# Altium project SAMC21_Xplained_Pro.PrjPCB (part 2 of 2)

## Sheet SAMC21_Xplained_Pro_CAN_LIN.SchDoc: CAN & LIN Interface
size A3; Organization: ATMEL Norway; Address1: Vestre Rosten 79; Address2: N-7075 TILLER; Address3: NORWAY; DocumentNumber: A09-2419; Revision: 5; SheetNumber: 6; SheetTotal: 9; PageSetup: Record=PageOptions|CenterHorizontal=True|CenterVertical=True|PrintScale=1.01|XCorrection=1.00|YCorrection=1.00|PrintKind=1|BorderSize=5000000|LeftOffset=0|BottomOffset=0|Orientation=2|PaperLength=1000|PaperWidth=1000|Scale=100|PaperSource=7|PrintQuality=-4|MediaType=1|DitherType=10|PaperKind=A3 (297 x 420 mm)|PrintScaleMode=1; ProjectName: SAM C21 Xplained Pro
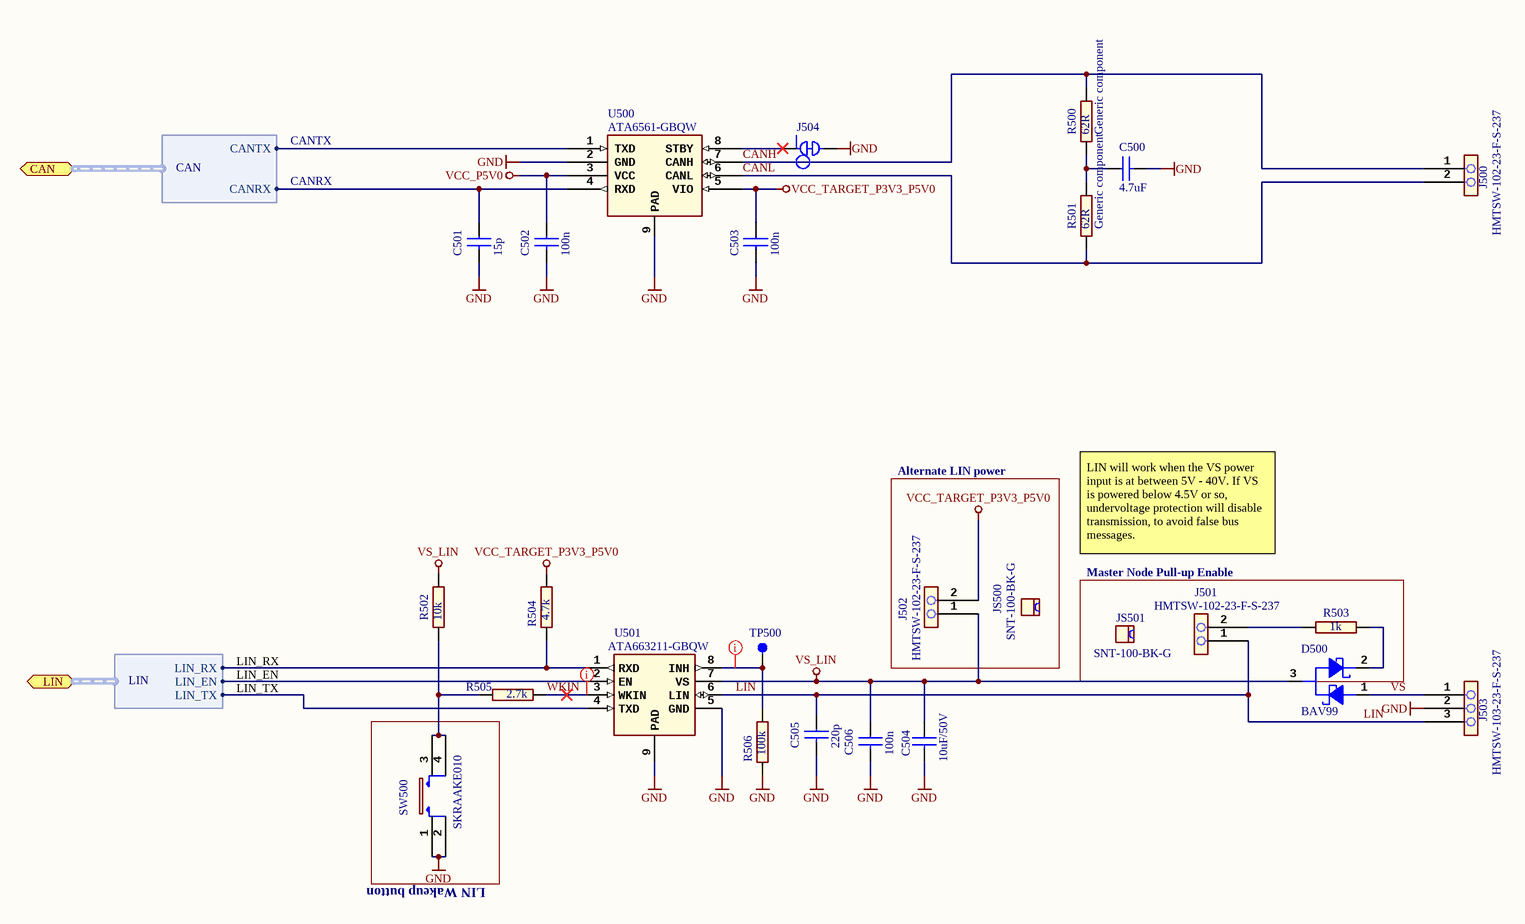
[diagram p5: SAMC21_Xplained_Pro_CAN_LIN.SchDoc]

### Parts
C500  value 4.7uF  [AP1-00003]
C501  value 15p  [AP1-00001]
C502  value 100n  [AP1-00001]
C503  value 100n  [AP1-00001]
C504  value 10uF/50V  [AP1-00015]
C505  value 220p  [AP1-00001]
C506  value 100n  [AP1-00001]
D500  value BAV99  [AP4-00018]
J500  value HMTSW-102-23-F-S-237  [AP8-00733]
J501  value HMTSW-102-23-F-S-237  [AP8-00733]
J502  value HMTSW-102-23-F-S-237  [AP8-00733]
J503  value HMTSW-103-23-F-S-237  [AP8-00745]
J504  (no value)  [AP9-00044]  (net tie, no BOM)
JS500  value SNT-100-BK-G  [AP8-00525]
JS501  value SNT-100-BK-G  [AP8-00525]
R500  Generic component  value 62R  [AP2-00008]
R501  Generic component  value 62R  [AP2-00008]
R502  value 10k  [AP2-00000]
R503  value 1k  [AP2-00000]
R504  value 4.7k  [AP2-00000]
R505  value 2.7k  [AP2-00000]
R506  value 100k  [AP2-00000]
SW500  value SKRAAKE010  [AP8-00137]
TP500  (no value)  [AP8-00010]  (no BOM)
U500  value ATA6561-GBQW  [AP6-00407]
U501  value ATA663211-GBQW  [AP6-00407]

### Blocks framed on the sheet
Alternate LIN power: J502 JS500
Master Node Pull-up Enable: D500 J501 JS501 R503
LIN Wakeup button: SW500

### Ports
CAN (harness CAN), LIN (harness LIN)

### Harnesses
CAN: CANTX, CANRX
LIN: LIN_RX, LIN_EN, LIN_TX

### Nets
GND: C500.2 C501.2 C502.2 C503.2 C504.2 C505.2 C506.2 J503.2 J504.2 R506.1 SW500.1 SW500.2 U500.2(GND) U500.9(PAD) U501.5(GND) U501.9(PAD)
VCC_P5V0: C502.1 U500.3(VCC)
VCC_TARGET_P3V3_P5V0: C503.1 J502.2 R504.2 U500.5(VIO)
VS_LIN: C504.1 C506.1 D500.3(ANODE_CATHODE) J502.1 R502.2 U501.7(VS)
CANH: J500.1 R500.2 U500.7(CANH)
CANL: J500.2 R501.1 U500.6(CANL)
LIN: C505.1 J501.1 J503.3 U501.6(LIN)
PA06_S0_LIN_TX: U501.4(TXD) ; port LIN.LIN_TX
PA07_S0_LIN_RX: R504.1 U501.1(RXD) ; port LIN.LIN_RX
PA24_CAN0_TX: U500.1(TXD) ; port CAN.CANTX
PA25_CAN0_RX: C501.1 U500.4(RXD) ; port CAN.CANRX
PB22_LIN_EN: U501.2(EN) ; port LIN.LIN_EN
VS: D500.1(ANODE) J503.1
WKIN: R505.2 U501.3(WKIN)
NetC500_1: C500.1 R500.1 R501.2
NetD500_2: D500.2(CATHODE) R503.2
NetJ501_2: J501.2 R503.1
NetJ504_1: J504.1 U500.8(STBY)
NetR502_1: R502.1 R505.1 SW500.3 SW500.4
NetR506_2: R506.2 TP500.1 U501.8(INH)

### Layout directives
rule Assembly Testpoint Usage [Testpoint - Not Allowed    Multiple - Not Allowed]: NetR506_2, WKIN

### Notes on the sheet
- CANTX
- CANRX
- LIN will work when the VS power input is at between 5V - 40V. If VS is powered below 4.5V or so, undervoltage protection will disable transmission, to avoid false bus messages.
- LIN_RX
- LIN_TX
- LIN_EN
- Date:
- PAGE:
- of
- TITLE:
- Document number:
- Revision:

### Library data of the parts
C500 = A01-0400: Ceramic capacitor, SMD 0805, X5R, 25V, ±10 %; PartGroup: Capacitors,Ceramic,SMD 0805; Manufacturer: Murata; MPN: GRM21BR61E475KA12L; Tolerance: Â±10%; AN: A01-0400; Height: 1,25
C501 = A01-0017: Ceramic capacitor, SMD 0402, NP0, 50V, +/-5%; PartGroup: Capacitors,Ceramic,SMD 0402; TemperatureRange: -55 - +125 deg C; AN: A01-0017; Tolerance: 50V, +/-5%; Height: 0,550000011920929
C502 C503 C506 = A01-0246: as C304 on sheet SAMC21_Xplained_Pro_Target_MCU; AN: A01-0246; Tolerance: 16V, +/-10%; Height: 0,5
C504 = A01-0586: Ceramic capacitor, SMD 1210, X7S , 50V, Â±10%; PartGroup: Capacitors,Ceramic,SMD 1210; Manufacturer: tdk; MPN: CGA6P3X7S1H106K250AB; TemperatureRange: -55 - +125 deg C; AN: A01-0586; Tolerance: 50V, Â±10%; Height: 2,5
C505 = A01-0030: Ceramic capacitor, SMD 0402, X7R, 50V, +/-10%; PartGroup: Capacitors,Ceramic,SMD 0402; TemperatureRange: -55 - +125 deg C; AN: A01-0030; Tolerance: 50V, +/-10%; Height: 0,550000011920929
D500 = A04-0011: High-speed Double Diode; PartGroup: Diodes,Schottky; Manufacturer: Philips; AN: A04-0011; Height: 1,10000002384186; MPN: BAV99
J500-J502 = A08-1754: 1x2 pin header, 2.54mm pitch, Pin-in-Paste THM; PartGroup: Mechanical devices,Connectors,Pin headers; Manufacturer: SAMTEC; TemperatureRange: - 55 deg C to + 125 deg C; AN: A08-1754; Height: 6,09999990463257; MPN: HMTSW-102-23-F-S-237
J503 = A08-1799: 1x3 pin header, 2.54mm pitch, Pin-in-Paste THM, 1mm hole; PartGroup: Mechanical devices,Connectors,Pin headers; Manufacturer: SAMTEC; AN: A08-1799; Height: 6,09999990463257; MPN: HMTSW-103-23-F-S-237
J504 = A09-0783: Default closed SMD strap, 0603 size; PartGroup: Mechanical devices,PCB implemented components; Value: SMD-STRAP_0603_CLOSED; AN: A09-0783; Height: 0
JS500 JS501 = A08-0543: Jumper cap for 2.54mm pinheader; PartGroup: Mechanical devices,Mounting accessories,Other; Manufacturer: SAMTEC; AN: A08-0543; MPN: SNT-100-BK-G
R500 R501 = A02-0760: Thick film resistor, SMD 1210, 0.5W, 1%; PartGroup: Resistors,SMD,1210 1%; TemperatureRange: -55°C to +155°C; AN: A02-0760; Tolerance: 1%; Height: 0,699999988079071
R502 = A02-0236: as R105 on sheet SAMC21_Xplained_Pro_dual_input_power_supply; AN: A02-0236; Tolerance: 1 %; Height: 0,349999994039536
R503 = A02-0212: Thick film resistor, SMD 0402, 1/16W, 1%; PartGroup: Resistors,SMD,0402 1%; TemperatureRange: -55 - +125 deg C; AN: A02-0212; Tolerance: 1 %; Height: 0,349999994039536
R504 = A02-0228: as R305 on sheet SAMC21_Xplained_Pro_Target_MCU; AN: A02-0228; Tolerance: 1 %; Height: 0,349999994039536
R505 = A02-0222: Thick film resistor, SMD 0402, 1/16W, 1%; PartGroup: Resistors,SMD,0402 1%; TemperatureRange: -55 - +125 deg C; AN: A02-0222; Tolerance: 1 %; Height: 0,349999994039536
R506 = A02-0260: as R300 on sheet SAMC21_Xplained_Pro_Target_MCU; AN: A02-0260; Tolerance: 1 %; Height: 0,349999994039536
SW500 = A08-0790: as SW301 on sheet SAMC21_Xplained_Pro_Target_MCU; AN: A08-0790; Height: 5,09999990463257; MPN: SKRAAKE010
TP500 = A08-0004: as TP301 on sheet SAMC21_Xplained_Pro_Target_MCU; AN: A08-0004; Value: TESTPAD; Height: 0
U500 = A06-1172: 5Mbit/s CAN Trasceiver,VCC = 5V, VIO = 2.8-5V, 3x3 mm VDFN8; PartGroup: Integrated Circuits,Interface ICs,CAN; Manufacturer: ATMEL; AN: A06-1172; Height: 0,899999976158142; MPN: ATA6561-GBQW
U501 = A06-1194: LIN Transceiver; PartGroup: Integrated Circuits,Interface ICs,LIN; Manufacturer: ATMEL; AN: A06-1194; Height: 0,899999976158142; MPN: ATA663211-GBQW

## Sheet SAMC21_Xplained_Pro_Arduino_Connectors.SchDoc: Arduino Uno interface connectors
size A3; Organization: ATMEL Norway; Address1: Vestre Rosten 79; Address2: N-7075 TILLER; Address3: NORWAY; DocumentNumber: A09-2419; Revision: 5; SheetNumber: 9; SheetTotal: 9; PageSetup: Record=PageOptions|CenterHorizontal=True|CenterVertical=True|PrintScale=1.01|XCorrection=1.00|YCorrection=1.00|PrintKind=1|BorderSize=5000000|LeftOffset=0|BottomOffset=0|Orientation=2|PaperLength=1000|PaperWidth=1000|Scale=100|PaperSource=7|PrintQuality=-4|MediaType=1|DitherType=10|PaperKind=A3 (297 x 420 mm)|PrintScaleMode=1
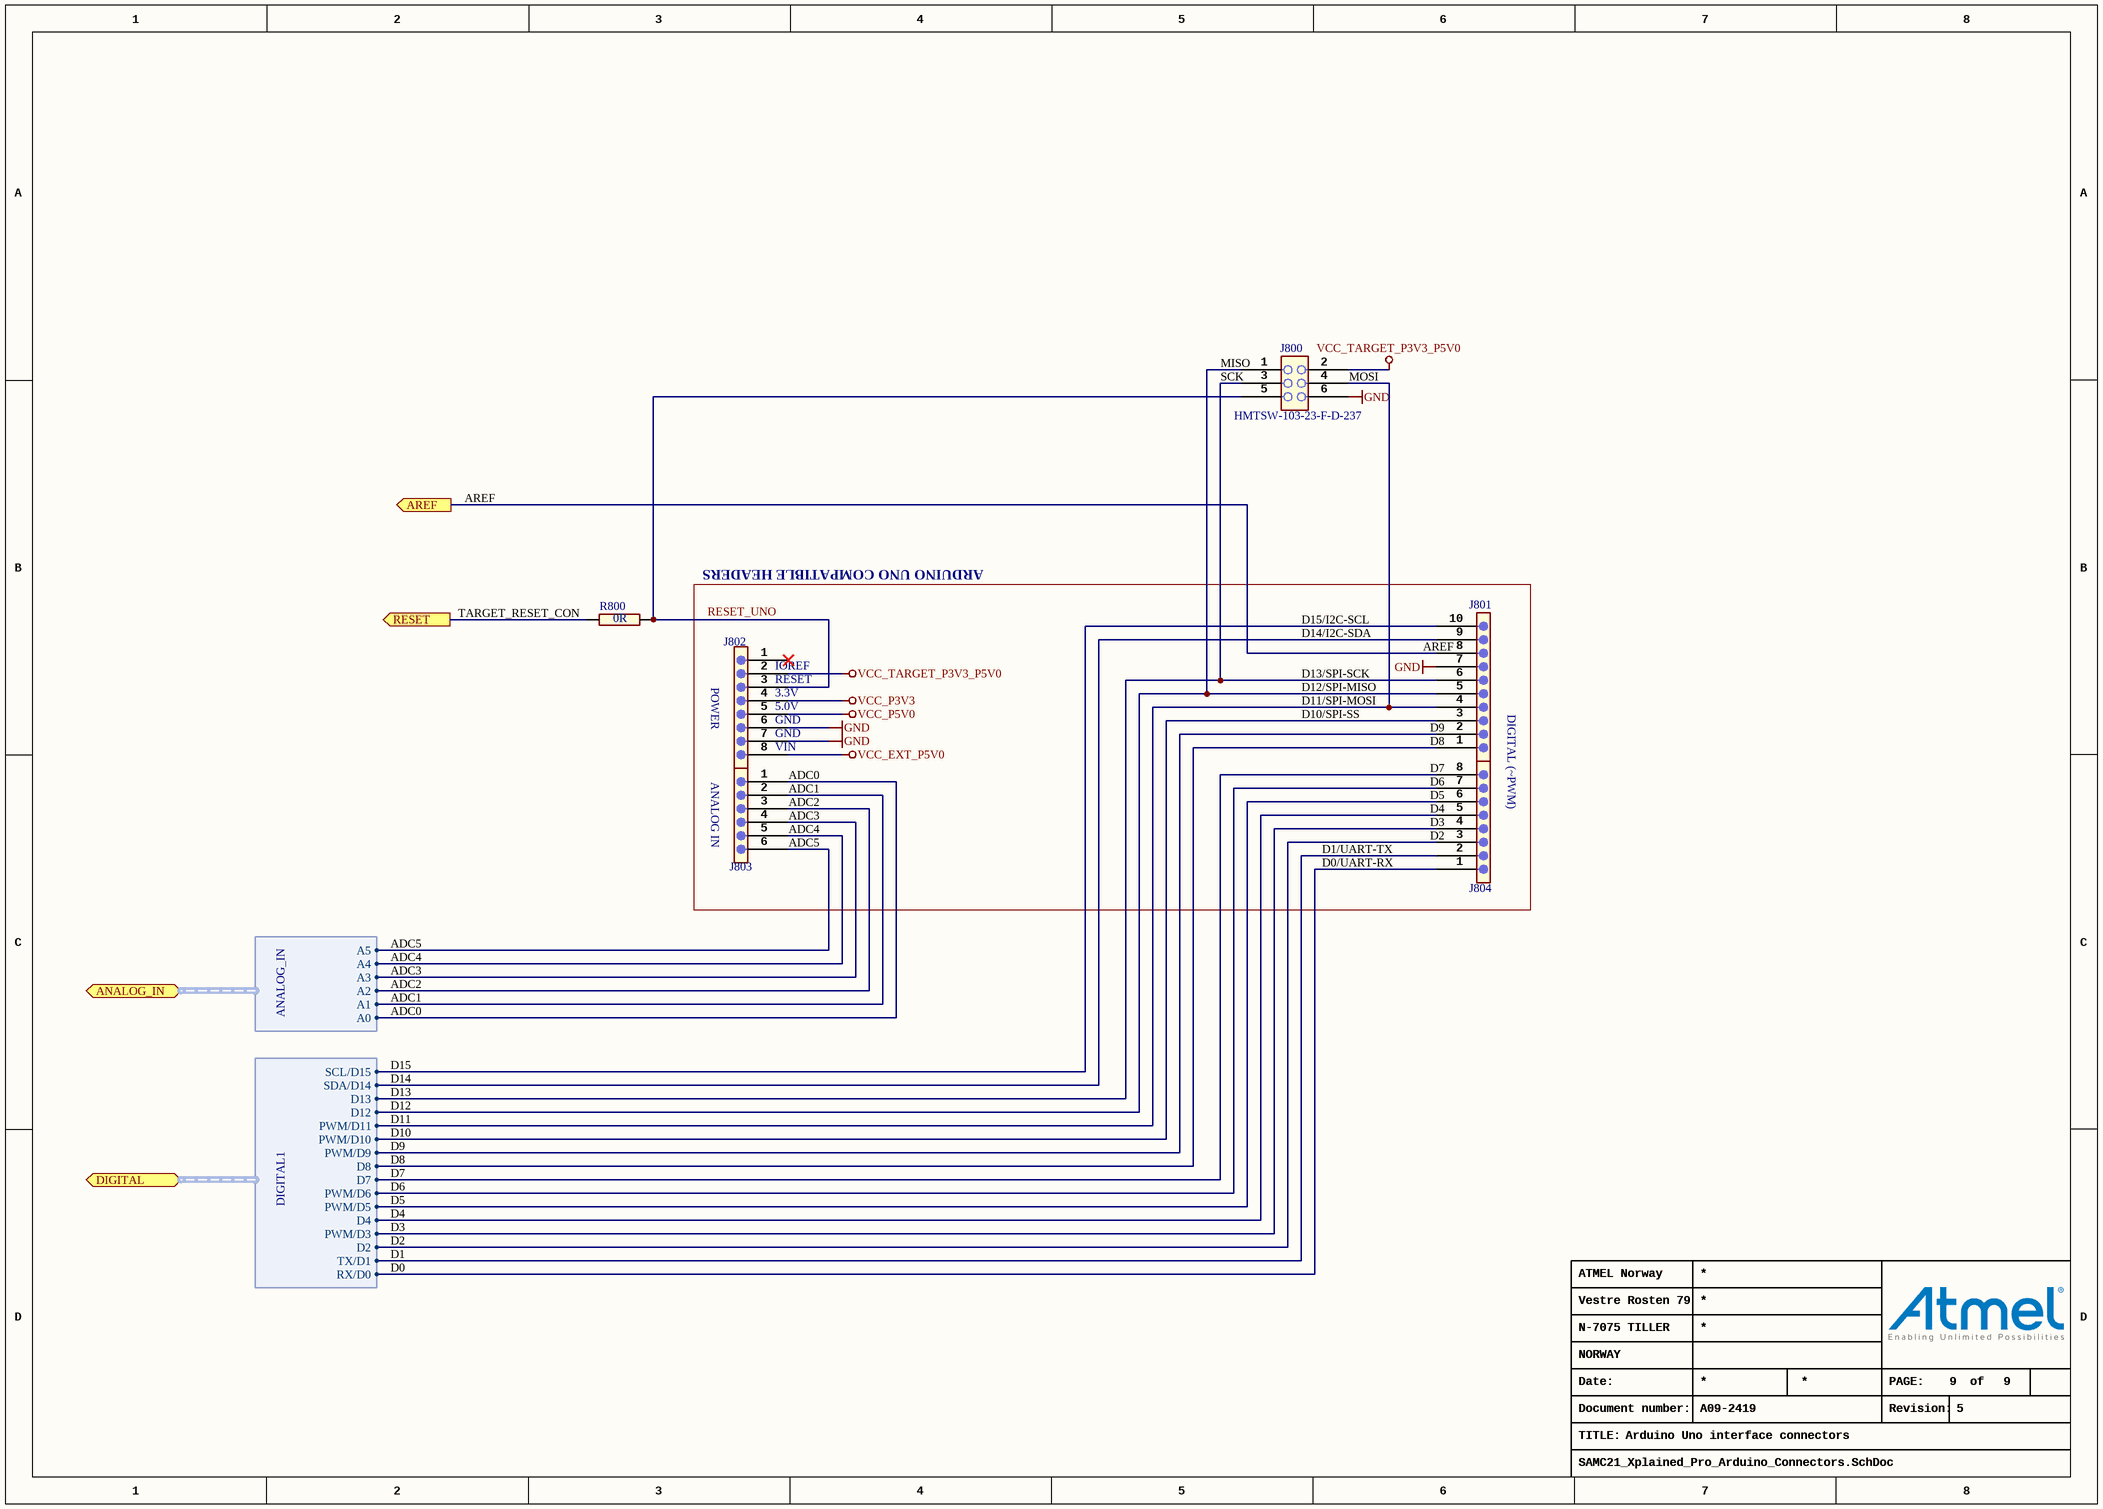
[diagram p6: SAMC21_Xplained_Pro_Arduino_Connectors.SchDoc]

### Parts
J800  value HMTSW-103-23-F-D-237  [AP8-00182]
J801  (no value)  [AP8-00822]
J802  (no value)  [AP8-00823]
J803  (no value)  [AP8-00824]
J804  (no value)  [AP8-00823]
R800  value 0R  [AP2-00000]

### Blocks framed on the sheet
ARDUINO UNO COMPATIBLE HEADERS: J801-J804

### Ports
ANALOG_IN (harness ANALOG_IN), AREF (out), DIGITAL (harness DIGITAL1), RESET (out)

### Harnesses
ANALOG_IN: A0, A1, A2, A3, A4, A5
DIGITAL1: RX/D0, TX/D1, D2, PWM/D3, D4, PWM/D5, PWM/D6, D7, D8, PWM/D9, PWM/D10, PWM/D11, D12, D13, SDA/D14, SCL/D15

### Nets
GND: J800.6 J801.7 J802.6 J802.7
VCC_EXT_P5V0: J802.8
VCC_P3V3: J802.4
VCC_P5V0: J802.5
VCC_TARGET_P3V3_P5V0: J800.2 J802.2
PA03_ADC_DAC_VREF: J801.8 ; port AREF
PA08_AIN10_X0: J803.3 ; port ANALOG_IN.A2
PA09_AIN11_X1: J803.4 ; port ANALOG_IN.A3
PA12_S2_I2C_SDA: J801.9 ; port DIGITAL.SDA/D14
PA13_S2_I2C_SCL: J801.10 ; port DIGITAL.SCL/D15
PA20_GPIO_RTS_TE_Y26: J804.3 ; port DIGITAL.D2
PA21_GPIO_CTS_Y27: J804.5 ; port DIGITAL.D4
PA22_S3_UART_TX: J804.2 ; port DIGITAL.TX/D1
PA23_S3_UART_RX: J804.1 ; port DIGITAL.RX/D0
PA27_GPIO_SS: J801.3 ; port DIGITAL.PWM/D10
PB00_S5_SPI_MOSI: J800.4 J801.4 ; port DIGITAL.PWM/D11
PB01_S5_SPI_SCK: J800.3 J801.6 ; port DIGITAL.D13
PB02_S5_SPI_MISO: J800.1 J801.5 ; port DIGITAL.D12
PB04_GPIO: J804.8 ; port DIGITAL.D7
PB05_GPIO: J801.1 ; port DIGITAL.D8
PB06_AIN8_INN2: J803.6 ; port ANALOG_IN.A5
PB07_AIN9_INP2: J803.5 ; port ANALOG_IN.A4
PB08_INN1_Y14: J803.2 ; port ANALOG_IN.A1
PB09_INP1_Y15: J803.1 ; port ANALOG_IN.A0
PB12_PWM_TC0_W0: J804.4 ; port DIGITAL.PWM/D3
PB13_PWM_TC0_W1: J804.6 ; port DIGITAL.PWM/D5
PB30_PWM_TCC0_W0: J804.7 ; port DIGITAL.PWM/D6
PB31_PWM_TCC0_W1: J801.2 ; port DIGITAL.PWM/D9
RESET_UNO: J800.5 J802.3 R800.2
TARGET_RESET_CON: R800.1 ; port RESET

Not connected (* = marked no-connect by the designer): J802 1*

### Notes on the sheet
- (near J800) MISO
- (near J800) SCK
- (near J800) MOSI
- AREF
- (near R800) TARGET_RESET_CON
- D14/I2C-SDA
- D15/I2C-SCL
- (near J801) AREF
- (near J802) POWER
- (near J802) IOREF
- (near J802) RESET
- (near J802) 3.3V
- (near J802) 5.0V
- (near J802) GND
- D10/SPI-SS
- D11/SPI-MOSI
- D12/SPI-MISO
- D13/SPI-SCK
- D9
- DIGITAL (~PWM)
- ANALOG IN
- VIN
- ADC0
- ADC1
- D6
- D7
- D8
- ADC2
- (near J803) ADC3
- (near J803) ADC4
- (near J803) ADC5
- D0/UART-RX
- D1/UART-TX
- (near J804) D2
- (near J804) D3
- (near J804) D4
- D5
- ADC3
- ADC4
- ADC5
- D10
- D11
- D12
- D13
- D14
- D15
- D0
- D1
- D2
- D3
- D4
- Date:
- PAGE:
- of
- TITLE:
- Document number:
- Revision:

### Library data of the parts
J800 = A08-1654: 2x3 pin header, 2.54mm pitch, Pin-in-Paste THM; PartGroup: Mechanical devices,Connectors,Pin headers; Manufacturer: SAMTEC; TemperatureRange: - 55 ï¿½C to + 125 ï¿½C; AN: A08-1654; Height: 6,09999990463257; MPN: HMTSW-103-23-F-D-237
J801 = A08-2026: 1x10 receptacle pin header, low insertion force, 2.54mm pitch THM, Pin in Paste; PartGroup: Mechanical devices,Connectors,Pin header receptacle; Manufacturer: SAMTEC; Value: SSQ-110-21-F-S; AN: A08-2026; Height: 8,51000022888184; MPN: SSQ-110-21-F-S
J802 J804 = A08-2025: 1x8 receptacle pin header, low insertion force, 2.54mm pitch THM, Pin in Paste; PartGroup: Mechanical devices,Connectors,Pin header receptacle; Manufacturer: SAMTEC; Value: SSQ-108-21-F-S; AN: A08-2025; Height: 8,51000022888184; MPN: SSQ-108-21-F-S
J803 = A08-2024: 1x6 receptacle pin header, low insertion force, 2.54mm pitch THM; PartGroup: Mechanical devices,Connectors,Pin header receptacle; Manufacturer: SAMTEC; Value: SSQ-106-21-F-S; AN: A08-2024; Height: 8,51000022888184; MPN: SSQ-106-21-F-S
R800 = A02-0163: RES 0.0 OHM 1/16W 0402 SMD; PartGroup: Resistors,SMD,0402 1%; Manufacturer: (n/a); MPN: RMCF0402ZT0R00; Tolerance: 1 %; TemperatureRange: -55 - +125 deg C; AN: A02-0163; Height: 0,349999994039536

## Sheet SAMC21_Xplained_Pro_Level_Converters.SchDoc: Data Level Converters
size A3; Organization: ATMEL Norway; Address1: Vestre Rosten 79; Address2: N-7075 TILLER; Address3: NORWAY; DocumentNumber: A09-2419; Revision: 5; SheetNumber: 7; SheetTotal: 9; PageSetup: Record=PageOptions|CenterHorizontal=True|CenterVertical=True|PrintScale=0.71|XCorrection=1.00|YCorrection=1.00|PrintKind=0|BorderSize=5000000|LeftOffset=0|BottomOffset=0|Orientation=2|PaperLength=1000|PaperWidth=1000|Scale=100|PaperSource=15|PrintQuality=600|MediaType=1|DitherType=10|PrintScaleMode=1|PaperKind=A4 (210 x 297 mm)|PaperIndex=9
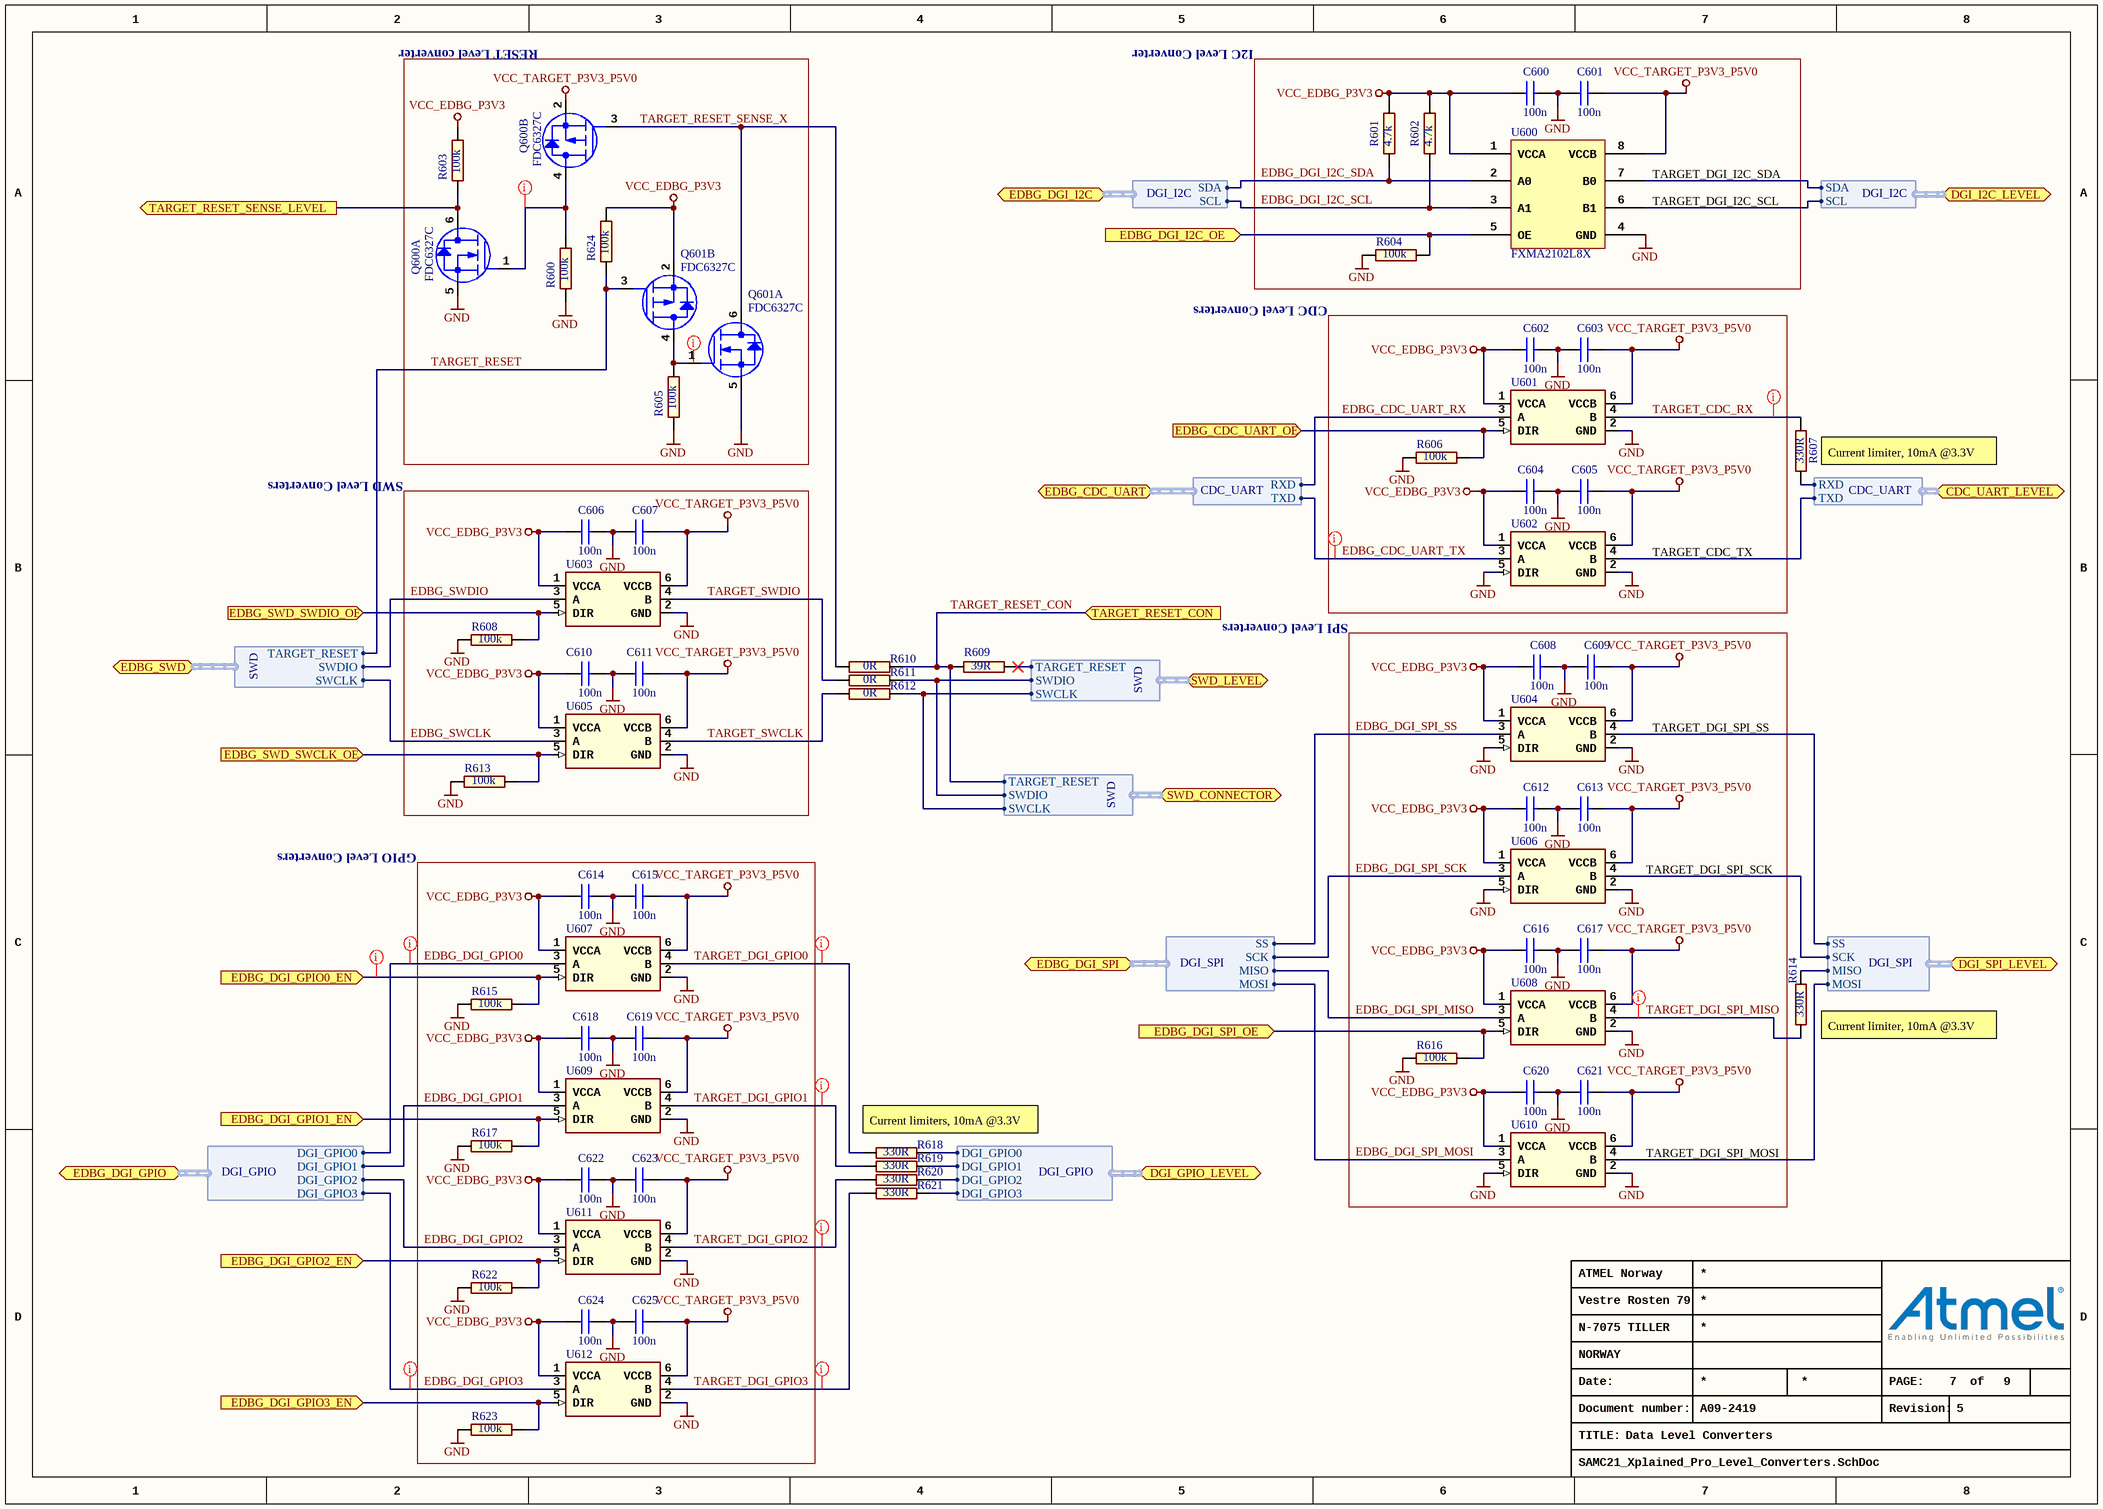
[diagram p7: SAMC21_Xplained_Pro_Level_Converters.SchDoc]

### Parts
C600  value 100n  [AP1-00053]
C601  value 100n  [AP1-00053]
C602  value 100n  [AP1-00053]
C603  value 100n  [AP1-00053]
C604  value 100n  [AP1-00053]
C605  value 100n  [AP1-00053]
C606  value 100n  [AP1-00053]
C607  value 100n  [AP1-00053]
C608  value 100n  [AP1-00053]
C609  value 100n  [AP1-00053]
C610  value 100n  [AP1-00053]
C611  value 100n  [AP1-00053]
C612  value 100n  [AP1-00053]
C613  value 100n  [AP1-00053]
C614  value 100n  [AP1-00053]
C615  value 100n  [AP1-00053]
C616  value 100n  [AP1-00053]
C617  value 100n  [AP1-00053]
C618  value 100n  [AP1-00053]
C619  value 100n  [AP1-00053]
C620  value 100n  [AP1-00053]
C621  value 100n  [AP1-00053]
C622  value 100n  [AP1-00053]
C623  value 100n  [AP1-00053]
C624  value 100n  [AP1-00053]
C625  value 100n  [AP1-00053]
Q600  value FDC6327C  [AP5-00008]  (hidden comment: Farnell no: 9844856)  (parts A,B of 2)
Q601  value FDC6327C  [AP5-00008]  (hidden comment: Farnell no: 9844856)  (parts A,B of 2)
R600  value 100k  [AP2-00011]
R601  value 4.7k  [AP2-00011]
R602  value 4.7k  [AP2-00011]
R603  value 100k  [AP2-00011]
R604  value 100k  [AP2-00011]
R605  value 100k  [AP2-00011]
R606  value 100k  [AP2-00011]
R607  value 330R  [AP2-00011]
R608  value 100k  [AP2-00011]
R609  value 39R  [AP2-00011]
R610  value 0R  [AP2-00000]
R611  value 0R  [AP2-00000]
R612  value 0R  [AP2-00000]
R613  value 100k  [AP2-00011]
R614  value 330R  [AP2-00011]
R615  value 100k  [AP2-00011]
R616  value 100k  [AP2-00011]
R617  value 100k  [AP2-00011]
R618  value 330R  [AP2-00011]
R619  value 330R  [AP2-00011]
R620  value 330R  [AP2-00011]
R621  value 330R  [AP2-00011]
R622  value 100k  [AP2-00011]
R623  value 100k  [AP2-00011]
R624  value 100k  [AP2-00011]
U600  value FXMA2102L8X  [AP6-00258]
U601  (no value)  [AP6-00015]
U602  (no value)  [AP6-00015]
U603  (no value)  [AP6-00015]
U604  (no value)  [AP6-00015]
U605  (no value)  [AP6-00015]
U606  (no value)  [AP6-00015]
U607  (no value)  [AP6-00015]
U608  (no value)  [AP6-00015]
U609  (no value)  [AP6-00015]
U610  (no value)  [AP6-00015]
U611  (no value)  [AP6-00015]
U612  (no value)  [AP6-00015]

### Blocks framed on the sheet
RESET Level converter: Q600 Q601 R600 R603 R605 R624
I2C Level Converter: C600 C601 R601 R602 R604 U600
CDC Level Converters: C602-C605 R606 U601 U602
SWD Level Converters: C606 C607 C610 C611 R608 R613 U603 U605
SPI Level Converters: C608 C609 C612 C613 C616 C617 C620 C621 R616 U604 U606 U608 U610
GPIO Level Converters: C614 C615 C618 C619 C622-C625 R615 R617 R622 R623 U607 U609 U611 U612

### Ports
CDC_UART_LEVEL (harness CDC_UART), DGI_GPIO_LEVEL (harness DGI_GPIO), DGI_I2C_LEVEL (harness DGI_I2C), DGI_SPI_LEVEL (harness DGI_SPI), EDBG_CDC_UART (harness CDC_UART), EDBG_CDC_UART_OE (in), EDBG_DGI_GPIO0_EN (in), EDBG_DGI_GPIO1_EN (in), EDBG_DGI_GPIO2_EN (in), EDBG_DGI_GPIO3_EN (in), EDBG_DGI_GPIO (harness DGI_GPIO), EDBG_DGI_I2C (harness DGI_I2C), EDBG_DGI_I2C_OE (in), EDBG_DGI_SPI (harness DGI_SPI), EDBG_DGI_SPI_OE (in), EDBG_SWD (harness SWD), EDBG_SWD_SWCLK_OE (in), EDBG_SWD_SWDIO_OE (in), SWD_CONNECTOR (harness SWD), SWD_LEVEL (harness SWD), TARGET_RESET_CON (in), TARGET_RESET_SENSE_LEVEL (out)

### Harnesses
DGI_GPIO: DGI_GPIO0, DGI_GPIO1, DGI_GPIO2, DGI_GPIO3
DGI_SPI: MISO, MOSI, SCK, SS
DGI_I2C: SCL, SDA
CDC_UART: RXD, TXD
SWD: SWCLK, SWDIO, TARGET_RESET

### Nets
GND: C600.2 C601.1 C602.2 C603.1 C604.2 C605.1 C606.2 C607.1 C608.2 C609.1 C610.2 C611.1 C612.2 C613.1 C614.2 C615.1 C616.2 C617.1 C618.2 C619.1 C620.2 C621.1 C622.2 C623.1 C624.2 C625.1 Q600.5(S) Q601.5(S) R600.1 R604.1 R605.1 R606.2 R608.2 R613.2 R615.2 R616.2 R617.2 R622.2 R623.2 U600.4(GND) U601.2(GND) U602.2(GND) U602.5(DIR) U603.2(GND) U604.2(GND) U604.5(DIR) U605.2(GND) U606.2(GND) U606.5(DIR) U607.2(GND) U608.2(GND) U609.2(GND) U610.2(GND) U610.5(DIR) U611.2(GND) U612.2(GND)
VCC_EDBG_P3V3: C600.1 C602.1 C604.1 C606.1 C608.1 C610.1 C612.1 C614.1 C616.1 C618.1 C620.1 C622.1 C624.1 Q601.2(S) R601.2 R602.2 R603.2 R624.2 U600.1(VCCA) U601.1(VCCA) U602.1(VCCA) U603.1(VCCA) U604.1(VCCA) U605.1(VCCA) U606.1(VCCA) U607.1(VCCA) U608.1(VCCA) U609.1(VCCA) U610.1(VCCA) U611.1(VCCA) U612.1(VCCA)
VCC_TARGET_P3V3_P5V0: C601.2 C603.2 C605.2 C607.2 C609.2 C611.2 C613.2 C615.2 C617.2 C619.2 C621.2 C623.2 C625.2 Q600.2(S) U600.8(VCCB) U601.6(VCCB) U602.6(VCCB) U603.6(VCCB) U604.6(VCCB) U605.6(VCCB) U606.6(VCCB) U607.6(VCCB) U608.6(VCCB) U609.6(VCCB) U610.6(VCCB) U611.6(VCCB) U612.6(VCCB)
EDBG_CDC_UART_OE: R606.1 U601.5(DIR) ; port EDBG_CDC_UART_OE
EDBG_CDC_UART_RX: U601.3(A) ; port EDBG_CDC_UART.RXD
EDBG_CDC_UART_TX: U602.3(A) ; port EDBG_CDC_UART.TXD
EDBG_DGI_GPIO0: U607.3(A) ; port EDBG_DGI_GPIO.DGI_GPIO0
EDBG_DGI_GPIO0_EN: R615.1 U607.5(DIR) ; port EDBG_DGI_GPIO0_EN
EDBG_DGI_GPIO1: U609.3(A) ; port EDBG_DGI_GPIO.DGI_GPIO1
EDBG_DGI_GPIO1_EN: R617.1 U609.5(DIR) ; port EDBG_DGI_GPIO1_EN
EDBG_DGI_GPIO2: U611.3(A) ; port EDBG_DGI_GPIO.DGI_GPIO2
EDBG_DGI_GPIO2_EN: R622.1 U611.5(DIR) ; port EDBG_DGI_GPIO2_EN
EDBG_DGI_GPIO3: U612.3(A) ; port EDBG_DGI_GPIO.DGI_GPIO3
EDBG_DGI_GPIO3_EN: R623.1 U612.5(DIR) ; port EDBG_DGI_GPIO3_EN
EDBG_DGI_I2C_OE: R604.2 U600.5(OE) ; port EDBG_DGI_I2C_OE
EDBG_DGI_I2C_SCL: R602.1 U600.3(A1) ; port EDBG_DGI_I2C.SCL
EDBG_DGI_I2C_SDA: R601.1 U600.2(A0) ; port EDBG_DGI_I2C.SDA
EDBG_DGI_SPI_MISO: U608.3(A) ; port EDBG_DGI_SPI.MISO
EDBG_DGI_SPI_MOSI: U610.3(A) ; port EDBG_DGI_SPI.MOSI
EDBG_DGI_SPI_OE: R616.1 U608.5(DIR) ; port EDBG_DGI_SPI_OE
EDBG_DGI_SPI_SCK: U606.3(A) ; port EDBG_DGI_SPI.SCK
EDBG_DGI_SPI_SS: U604.3(A) ; port EDBG_DGI_SPI.SS
EDBG_SWCLK: U605.3(A) ; port EDBG_SWD.SWCLK
EDBG_SWD_SWCLK_OE: R613.1 U605.5(DIR) ; port EDBG_SWD_SWCLK_OE
EDBG_SWD_SWDIO_OE: R608.1 U603.5(DIR) ; port EDBG_SWD_SWDIO_OE
EDBG_SWDIO: U603.3(A) ; port EDBG_SWD.SWDIO
PA12_S2_I2C_SDA: U600.7(B0) ; port DGI_I2C_LEVEL.SDA
PA13_S2_I2C_SCL: U600.6(B1) ; port DGI_I2C_LEVEL.SCL
PA28_GPIO_IRQ8: R621.2 ; port DGI_GPIO_LEVEL.DGI_GPIO3
PA30_SWCLK: R612.2 ; port SWD_LEVEL.SWCLK, port SWD_CONNECTOR.SWCLK
PA31_SWDIO: R611.2 ; port SWD_LEVEL.SWDIO, port SWD_CONNECTOR.SWDIO
PB00_S5_SPI_MOSI: U610.4(B) ; port DGI_SPI_LEVEL.MOSI
PB01_S5_SPI_SCK: U606.4(B) ; port DGI_SPI_LEVEL.SCK
PB02_S5_SPI_MISO: R614.2 ; port DGI_SPI_LEVEL.MISO
PB10_S4_CDC_TX: U602.4(B) ; port CDC_UART_LEVEL.TXD
PB11_S4_CDC_RX: R607.1 ; port CDC_UART_LEVEL.RXD
PB12_PWM_TC0_W0: R618.2 ; port DGI_GPIO_LEVEL.DGI_GPIO0
PB16_GPIO_IRQ0: R619.2 ; port DGI_GPIO_LEVEL.DGI_GPIO1
PB17_GPIO_SS: R620.2 ; port DGI_GPIO_LEVEL.DGI_GPIO2
PB23_SS_EN: U604.4(B) ; port DGI_SPI_LEVEL.SS
TARGET_CDC_RX: R607.2 U601.4(B)
TARGET_DGI_GPIO0: R618.1 U607.4(B)
TARGET_DGI_GPIO1: R619.1 U609.4(B)
TARGET_DGI_GPIO2: R620.1 U611.4(B)
TARGET_DGI_GPIO3: R621.1 U612.4(B)
TARGET_DGI_SPI_MISO: R614.1 U608.4(B)
TARGET_RESET: Q601.3(G) R624.1 ; port EDBG_SWD.TARGET_RESET
TARGET_RESET_CON: R609.1 R610.2 ; port TARGET_RESET_CON, port SWD_CONNECTOR.TARGET_RESET
TARGET_RESET_SENSE: R609.2 ; port SWD_LEVEL.TARGET_RESET
TARGET_RESET_SENSE_LEVEL: Q600.6(D) R603.1 ; port TARGET_RESET_SENSE_LEVEL
TARGET_RESET_SENSE_X: Q600.3(G) Q601.6(D) R610.1
TARGET_SWCLK: R612.1 U605.4(B)
TARGET_SWDIO: R611.1 U603.4(B)
NetQ600_1: Q600.1(G) Q600.4(D) R600.2
NetQ601_1: Q601.1(G) Q601.4(D) R605.2

### Layout directives
rule Assembly Testpoint Usage [Testpoint - Not Allowed    Multiple - Not Allowed]: (no net found under the mark), EDBG_CDC_UART_TX, EDBG_DGI_GPIO0, EDBG_DGI_GPIO0_EN, EDBG_DGI_GPIO3, NetQ600_1, TARGET_CDC_RX, TARGET_DGI_GPIO0, TARGET_DGI_GPIO1, TARGET_DGI_GPIO2, TARGET_DGI_GPIO3, TARGET_DGI_SPI_MISO

### Notes on the sheet
- (near U600) TARGET_DGI_I2C_SDA
- (near U600) TARGET_DGI_I2C_SCL
- (near R607) Current limiter, 10mA @3.3V
- (near U602) TARGET_CDC_TX
- (near U604) TARGET_DGI_SPI_SS
- (near U606) TARGET_DGI_SPI_SCK
- (near R614) Current limiter, 10mA @3.3V
- Current limiters, 10mA @3.3V
- (near U610) TARGET_DGI_SPI_MOSI
- Date:
- PAGE:
- of
- TITLE:
- Document number:
- Revision:

### Library data of the parts
C600-C625 = A01-0246: Ceramic capacitor, SMD 0402, X7R, 16V, +/-10%; PartGroup: Capacitors,Ceramic,SMD 0402; Manufacturer: Kemet; MPN: C0402C104K4RACTU; TemperatureRange: -55 - +125 deg C; AN: A01-0246; Tolerance: 16V, +/-10%; Height: 0,5
Q600 Q601 = A05-0040: Dual N/P-ch MOSFET, 20V, 2.7A/-1.9A cont, 8A/-8A pulse, RDS(ON)<0.08/0.17Ohm@VGS=4.5V, VGS(th)<1.5/-1.5V, SSOT6; PartGroup: Transistors,Power FET,SMD; Manufacturer: Fairchild; TemperatureRange: -55 - +150 deg C; AN: A05-0040; Height: 1,10000002384186; MPN: FDC6327C
R600 R603-R606 R608 R613 R615-R617 R622-R624 = A02-0260: Thick film resistor, SMD 0402, 1/16W, 1%; PartGroup: Resistors,SMD,0402 1%; TemperatureRange: -55ï¿½ to +125ï¿½C; AN: A02-0260; Tolerance: 1 %; Height: 0,349999994039536
R601 R602 = A02-0228: Thick film resistor, SMD 0402, 1/16W, 1%; PartGroup: Resistors,SMD,0402 1%; TemperatureRange: -55ï¿½ to +125ï¿½C; AN: A02-0228; Tolerance: 1 %; Height: 0,349999994039536
R607 R614 R618-R621 = A02-0200: Thick film resistor, SMD 0402, 1/16W, 1%; PartGroup: Resistors,SMD,0402 1%; TemperatureRange: -55 - +125 deg C; AN: A02-0200; Tolerance: 1 %; Height: 0,349999994039536
R609 = A02-0178: Thick film resistor, SMD 0402, 1/16W, 1%; PartGroup: Resistors,SMD,0402 1%; TemperatureRange: -55 - +125 deg C; AN: A02-0178; Tolerance: 1 %; Height: 0,349999994039536
R610-R612 = A02-0163: Thick film resistor, SMD 0402, 1/16W, 1%; PartGroup: Resistors,SMD,0402 1%; Manufacturer: (n/a); MPN: RMCF0402ZT0R00; TemperatureRange: -55 - +125 deg C; AN: A02-0163; Tolerance: 1 %; Height: 0,349999994039536
U600 = A06-0714: Dual supply, 2-bit, voltage translator, buffer, repeater, isolator for I2C applications; PartGroup: Integrated Circuits,Interface ICs,I2C; Manufacturer: Fairchild; TemperatureRange: -40 - +85 deg C; AN: A06-0714; Height: 0,550000011920929; MPN: FXMA2102L8X
U601-U612 = A06-1038: Single-Bit Dual-Supply Bus Transceiver with Configurable Voltage Translation and 3-State Outputs; PartGroup: Integrated Circuits,Interface ICs,Level translators; Manufacturer: Texas Instruments; Value: SN74LVC1T45DCKR; TemperatureRange: –40 - 85 °C; AN: A06-1038; Height: 1,10000002384186; MPN: SN74LVC1T45DCKR

## Sheet SAMC21_Xplained_Pro_Peripherals.SchDoc: Arduino Uno interface connectors
size A3; Organization: ATMEL Norway; Address1: Vestre Rosten 79; Address2: N-7075 TILLER; Address3: NORWAY; DocumentNumber: A09-2419; Revision: 5; SheetNumber: 8; SheetTotal: 9; PageSetup: Record=PageOptions|CenterHorizontal=True|CenterVertical=True|PrintScale=1.01|XCorrection=1.00|YCorrection=1.00|PrintKind=1|BorderSize=5000000|LeftOffset=0|BottomOffset=0|Orientation=2|PaperLength=1000|PaperWidth=1000|Scale=100|PaperSource=7|PrintQuality=-4|MediaType=1|DitherType=10|PaperKind=A3 (297 x 420 mm)|PrintScaleMode=1
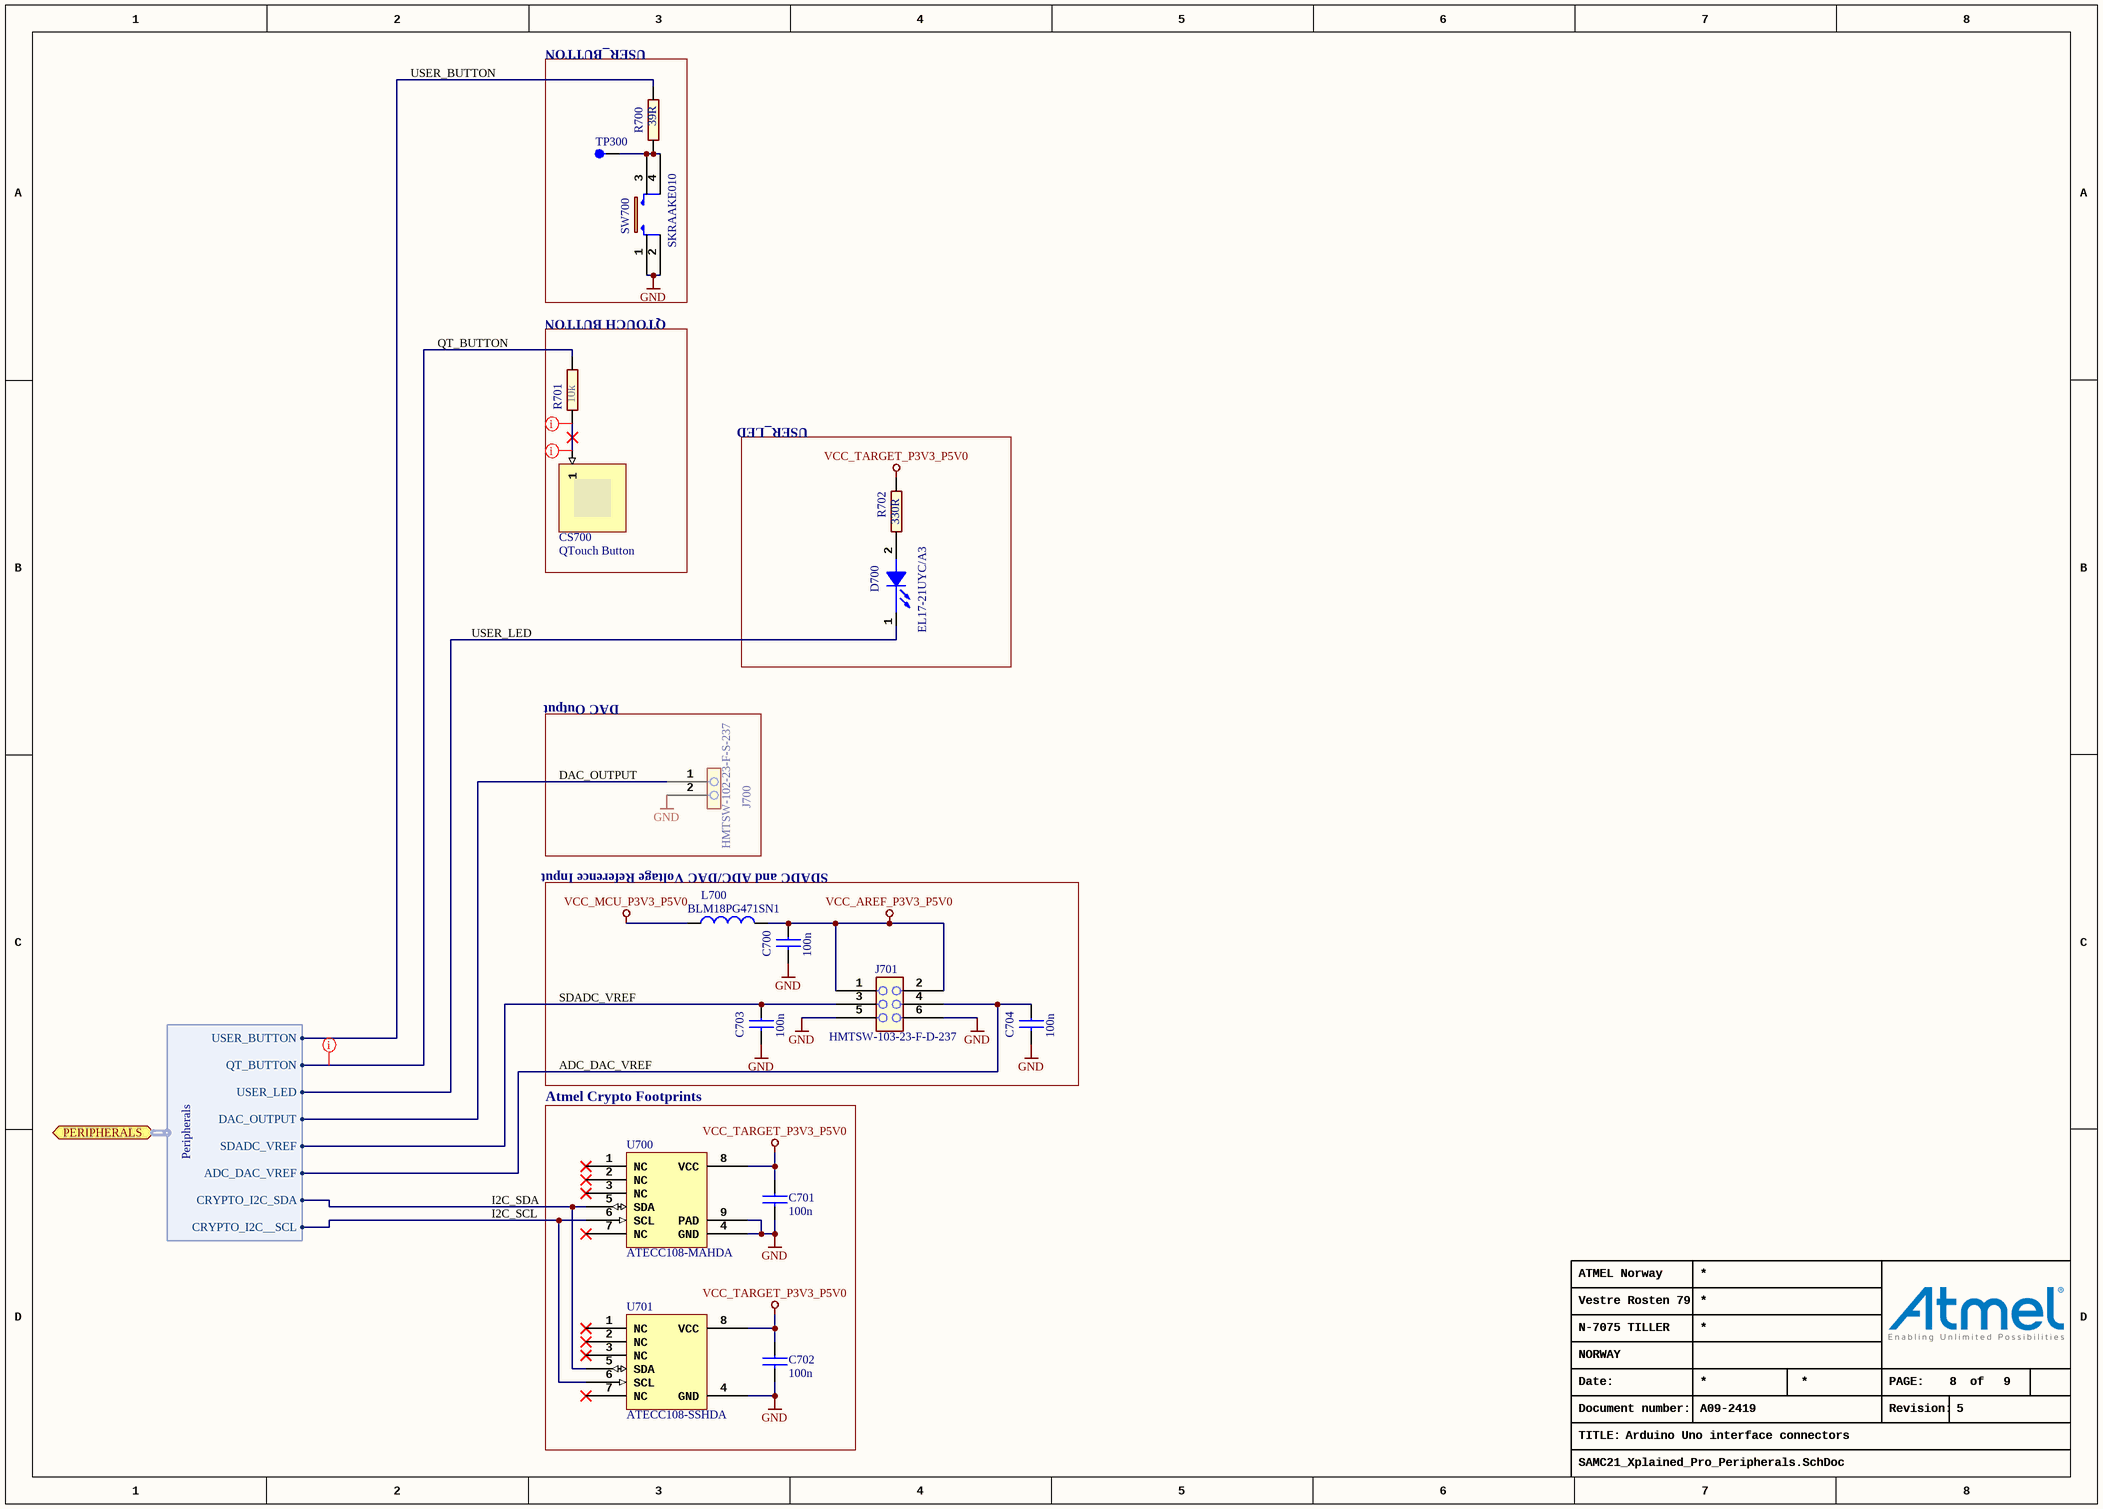
[diagram p8: SAMC21_Xplained_Pro_Peripherals.SchDoc]

### Parts
C700  value 100n  [AP1-00001]
C701  value 100n  [AP1-00001]
C702  value 100n  [AP1-00001]
C703  value 100n  [AP1-00001]
C704  value 100n  [AP1-00001]
CS700  QTouch Button  (no BOM)
D700  value EL17-21UYC/A3  [AP4-00013]
J700  value HMTSW-102-23-F-S-237  [AP8-00733]
J701  value HMTSW-103-23-F-D-237  [AP8-00182]
L700  value BLM18PG471SN1  [AP3-00005]
R700  value 39R  [AP2-00000]
R701  value 10k  [AP2-00000]
R702  value 330R  [AP2-00000]
SW700  value SKRAAKE010  [AP8-00137]  (hidden comment: same as A08-0091 but less force is needed; Can be ordered in low volumes from Mouser)
TP300  (no value)  [AP8-00010]  (no BOM)
U700  value ATECC108-MAHDA  [AP6-00409]
U701  value ATECC108-SSHDA  [AP6-00071]

### Blocks framed on the sheet
USER_BUTTON: R700 SW700 TP300
QTOUCH BUTTON: CS700 R701
USER_LED: D700 R702
DAC Output: J700
SDADC and ADC/DAC Voltage Reference Input: C700 C703 C704 J701 L700
Atmel Crypto Footprints: C701 C702 U700 U701

### Ports
PERIPHERALS (harness Peripherals)

### Harnesses
Peripherals: DAC_OUTPUT, ADC_DAC_VREF, SDADC_VREF, QT_BUTTON, USER_LED, USER_BUTTON, CRYPTO_I2C__SCL, CRYPTO_I2C_SDA

### Nets
GND: C700.2 C701.2 C702.2 C703.2 C704.2 J700.2 J701.5 J701.6 SW700.1 SW700.2 U700.4(GND) U700.9(PAD) U701.4(GND)
VCC_AREF_P3V3_P5V0: C700.1 J701.1 J701.2 L700.2
VCC_MCU_P3V3_P5V0: L700.1
VCC_TARGET_P3V3_P5V0: C701.1 C702.1 R702.2 U700.8(VCC) U701.8(VCC)
PA02_SPI_SS: J700.1 ; port PERIPHERALS.DAC_OUTPUT
PA03_ADC_DAC_VREF: C704.1 J701.4 ; port PERIPHERALS.ADC_DAC_VREF
PA04_SDADC_VREF: C703.1 J701.3 ; port PERIPHERALS.SDADC_VREF
PA05_QTB_Y3: R701.2 ; port PERIPHERALS.QT_BUTTON
PA12_S2_I2C_SDA: U700.5(SDA) U701.5(SDA) ; port PERIPHERALS.CRYPTO_I2C_SDA
PA13_S2_I2C_SCL: U700.6(SCL) U701.6(SCL) ; port PERIPHERALS.CRYPTO_I2C__SCL
PA15_PWM_TC4_W1: D700.1(CATHODE) ; port PERIPHERALS.USER_LED
PA28_GPIO_IRQ8: R700.2 ; port PERIPHERALS.USER_BUTTON
NetCS700_1: CS700.1 R701.1
NetD700_2: D700.2(ANODE) R702.1
NetR700_1: R700.1 SW700.3 SW700.4 TP300.1

Not connected (* = marked no-connect by the designer): U700 1(NC)* 2(NC)* 3(NC)* 7(NC)*; U701 1(NC)* 2(NC)* 3(NC)* 7(NC)*

### Layout directives
net class TOUCH; rule Clearance Constraint [Clearance = 0.6mm]: NetCS700_1
rule Assembly Testpoint Usage [Testpoint - Not Allowed    Multiple - Not Allowed]: NetCS700_1, PA05_QTB_Y3

### Notes on the sheet
- USER_BUTTON
- QT_BUTTON
- USER_LED
- DAC_OUTPUT
- SDADC_VREF
- ADC_DAC_VREF
- I2C_SDA
- I2C_SCL
- Date:
- PAGE:
- of
- TITLE:
- Document number:
- Revision:

### Library data of the parts
C700-C704 = A01-0246: as C600-C625 on sheet SAMC21_Xplained_Pro_Level_Converters; AN: A01-0246; Tolerance: 16V, +/-10%; Height: 0,5
CS700 = QTouchButton: ConfiguratorName: ATMEL_TOUCH; ConfigurationParameters: {}__sensorid[1]{}width[8]{}height[8]{}
D700 = A10-0019: LED, Yellow, Wave length=591nm, SMD 0805, ±70°; PartGroup: Opto,LEDs,SMD; Manufacturer: Everlight; MPN: 17-21UYC/S530-A3/TR8; TemperatureRange: -40 to +85 deg C; AN: A10-0019; Height: 1,10000002384186
J700 = A08-1754: 1x2 pin header, 2.54mm pitch, Pin-in-Paste THM; PartGroup: Mechanical devices,Connectors,Pin headers; Manufacturer: SAMTEC; TemperatureRange: - 55 deg C to + 125 deg C; AN: A08-1754; Height: 6,09999990463257; MPN: HMTSW-102-23-F-S-237
J701 = A08-1654: as J800 on sheet SAMC21_Xplained_Pro_Arduino_Connectors; AN: A08-1654; Height: 6,09999990463257; MPN: HMTSW-103-23-F-D-237
L700 = A03-0035: SMD RF inductor 0603. Z=470Ohm (@100MHz), Max R(dc)=0.65Ohm, Max current=1A; PartGroup: Inductors,EMI; Manufacturer: Murata; Tolerance: ±25%; TemperatureRange: -55°C to +125°C; AN: A03-0035; Height: 0,800000011920929; MPN: BLM18PG471SN1
R700 = A02-0178: as R609 on sheet SAMC21_Xplained_Pro_Level_Converters; AN: A02-0178; Tolerance: 1 %; Height: 0,349999994039536
R701 = A02-0236: Thick film resistor, SMD 0402, 1/16W, 1%; PartGroup: Resistors,SMD,0402 1%; Manufacturer: vishay; MPN: CRCW040210K0FKED; TemperatureRange: -55 - +125 deg C; AN: A02-0236; Tolerance: 1 %; Height: 0,349999994039536
R702 = A02-0200: as R607 on sheet SAMC21_Xplained_Pro_Level_Converters; AN: A02-0200; Tolerance: 1 %; Height: 0,349999994039536
SW700 = A08-0790: 6.2x6.2 mm SMD tact switch, same as A08-0091 but less force is needed; PartGroup: Mechanical devices,Switches,SMD; Manufacturer: ALPS; TemperatureRange: -30 - +90 deg C; AN: A08-0790; Height: 5,09999990463257; MPN: SKRAAKE010
TP300 = A08-0004: Single SMD testpad; PartGroup: Mechanical devices,Connectors,Test points; AN: A08-0004; Value: TESTPAD; Height: 0
U700 = A06-1181: Secure authentication and product validation device, EEPROM, I2C, 2.0 - 5.5V, UDFN8; PartGroup: Integrated Circuits,Special function,Encryption; Manufacturer: ATMEL; MPN: ATECC108-MAHDA-T; TemperatureRange: -40Â°C to +85Â°C; AN: A06-1181; Height: 0,600000023841858
U701 = A06-1182: Secure authentication and product validation device, EEPROM, I2C, 2.0 - 5.5V, SOIC8; PartGroup: Integrated Circuits,Special function,Encryption; Manufacturer: ATMEL; MPN: ATECC108-SSHDA-T; TemperatureRange: -40Â°C to +85Â°C; AN: A06-1182; Height: 1,75

## Nets that join several sheets
GND: SAMC21_Xplained_Pro_Target_MCU (23 pins), SAMC21_Xplained_Pro_EDBG (33 pins), SAMC21_Xplained_Pro_Connectors (9 pins), SAMC21_Xplained_Pro_dual_input_power_supply (23 pins), SAMC21_Xplained_Pro_CAN_LIN (16 pins), SAMC21_Xplained_Pro_Arduino_Connectors (J800.6 J801.7 J802.6 J802.7), SAMC21_Xplained_Pro_Level_Converters (56 pins), SAMC21_Xplained_Pro_Peripherals (13 pins)
VCC_EDBG_P3V3: SAMC21_Xplained_Pro_EDBG (23 pins), SAMC21_Xplained_Pro_dual_input_power_supply (J104.1), SAMC21_Xplained_Pro_Level_Converters (31 pins)
VCC_EDBG_USB_P5V0: SAMC21_Xplained_Pro_EDBG (C408.1 L401.2 U400.A10), SAMC21_Xplained_Pro_dual_input_power_supply (Q100.1 R103.2)
VCC_EXT_P5V0: SAMC21_Xplained_Pro_dual_input_power_supply (5 pins), SAMC21_Xplained_Pro_Arduino_Connectors (J802.8)
VCC_MCU_P3V3_P5V0: SAMC21_Xplained_Pro_Target_MCU (9 pins), SAMC21_Xplained_Pro_dual_input_power_supply (C108.1 J101.1), SAMC21_Xplained_Pro_Peripherals (L700.1)
VCC_P3V3: SAMC21_Xplained_Pro_dual_input_power_supply (J102.3 J105.1), SAMC21_Xplained_Pro_Arduino_Connectors (J802.4)
VCC_P5V0: SAMC21_Xplained_Pro_dual_input_power_supply (9 pins), SAMC21_Xplained_Pro_CAN_LIN (C502.1 U500.3), SAMC21_Xplained_Pro_Arduino_Connectors (J802.5)
VCC_TARGET_P3V3_P5V0: SAMC21_Xplained_Pro_Target_MCU (R300.2 R301.2 R305.2 R306.2), SAMC21_Xplained_Pro_Connectors (J200.20 J201.20 J202.20 J203.1), SAMC21_Xplained_Pro_dual_input_power_supply (J106.1), SAMC21_Xplained_Pro_CAN_LIN (C503.1 J502.2 R504.2 U500.5), SAMC21_Xplained_Pro_Arduino_Connectors (J800.2 J802.2), SAMC21_Xplained_Pro_Level_Converters (27 pins), SAMC21_Xplained_Pro_Peripherals (5 pins)
EDBG_ADC0: SAMC21_Xplained_Pro_EDBG (U400.K10), SAMC21_Xplained_Pro_dual_input_power_supply (R111.1 R112.2)
EDBG_ADC1: SAMC21_Xplained_Pro_EDBG (U400.H6), SAMC21_Xplained_Pro_dual_input_power_supply (R109.1 R110.2)
EDBG_CDC_UART_OE: SAMC21_Xplained_Pro_EDBG (U400.D4), SAMC21_Xplained_Pro_Level_Converters (R606.1 U601.5)
EDBG_CDC_UART_RX: SAMC21_Xplained_Pro_EDBG (U400.E9), SAMC21_Xplained_Pro_Level_Converters (U601.3)
EDBG_CDC_UART_TX: SAMC21_Xplained_Pro_EDBG (U400.F9), SAMC21_Xplained_Pro_Level_Converters (U602.3)
EDBG_DGI_GPIO0: SAMC21_Xplained_Pro_EDBG (U400.F8), SAMC21_Xplained_Pro_Level_Converters (U607.3)
EDBG_DGI_GPIO0_EN: SAMC21_Xplained_Pro_EDBG (U400.G2), SAMC21_Xplained_Pro_Level_Converters (R615.1 U607.5)
EDBG_DGI_GPIO1: SAMC21_Xplained_Pro_EDBG (U400.D8), SAMC21_Xplained_Pro_Level_Converters (U609.3)
EDBG_DGI_GPIO1_EN: SAMC21_Xplained_Pro_EDBG (U400.G3), SAMC21_Xplained_Pro_Level_Converters (R617.1 U609.5)
EDBG_DGI_GPIO2: SAMC21_Xplained_Pro_EDBG (U400.C10), SAMC21_Xplained_Pro_Level_Converters (U611.3)
EDBG_DGI_GPIO2_EN: SAMC21_Xplained_Pro_EDBG (U400.J1), SAMC21_Xplained_Pro_Level_Converters (R622.1 U611.5)
EDBG_DGI_GPIO3: SAMC21_Xplained_Pro_EDBG (U400.C9), SAMC21_Xplained_Pro_Level_Converters (U612.3)
EDBG_DGI_GPIO3_EN: SAMC21_Xplained_Pro_EDBG (U400.H1), SAMC21_Xplained_Pro_Level_Converters (R623.1 U612.5)
EDBG_DGI_I2C_OE: SAMC21_Xplained_Pro_EDBG (U400.A2), SAMC21_Xplained_Pro_Level_Converters (R604.2 U600.5)
EDBG_DGI_I2C_SCL: SAMC21_Xplained_Pro_EDBG (U400.F7), SAMC21_Xplained_Pro_Level_Converters (R602.1 U600.3)
EDBG_DGI_I2C_SDA: SAMC21_Xplained_Pro_EDBG (U400.G7), SAMC21_Xplained_Pro_Level_Converters (R601.1 U600.2)
EDBG_DGI_SPI_MISO: SAMC21_Xplained_Pro_EDBG (U400.K2), SAMC21_Xplained_Pro_Level_Converters (U608.3)
EDBG_DGI_SPI_MOSI: SAMC21_Xplained_Pro_EDBG (U400.K3), SAMC21_Xplained_Pro_Level_Converters (U610.3)
EDBG_DGI_SPI_OE: SAMC21_Xplained_Pro_EDBG (U400.H4), SAMC21_Xplained_Pro_Level_Converters (R616.1 U608.5)
EDBG_DGI_SPI_SCK: SAMC21_Xplained_Pro_EDBG (U400.J4), SAMC21_Xplained_Pro_Level_Converters (U606.3)
EDBG_DGI_SPI_SS: SAMC21_Xplained_Pro_EDBG (U400.G5), SAMC21_Xplained_Pro_Level_Converters (U604.3)
EDBG_SWCLK: SAMC21_Xplained_Pro_EDBG (U400.D6), SAMC21_Xplained_Pro_Level_Converters (U605.3)
EDBG_SWD_SWCLK_OE: SAMC21_Xplained_Pro_EDBG (U400.B7), SAMC21_Xplained_Pro_Level_Converters (R613.1 U605.5)
EDBG_SWD_SWDIO_OE: SAMC21_Xplained_Pro_EDBG (U400.K1), SAMC21_Xplained_Pro_Level_Converters (R608.1 U603.5)
EDBG_SWDIO: SAMC21_Xplained_Pro_EDBG (U400.C5), SAMC21_Xplained_Pro_Level_Converters (U603.3)
ID1: SAMC21_Xplained_Pro_EDBG (R409.1 U400.A1), SAMC21_Xplained_Pro_Connectors (J200.1)
ID2: SAMC21_Xplained_Pro_EDBG (R402.1 U400.B2), SAMC21_Xplained_Pro_Connectors (J201.1)
ID3: SAMC21_Xplained_Pro_EDBG (R401.1 U400.B3), SAMC21_Xplained_Pro_Connectors (J202.1)
PA02_SPI_SS: SAMC21_Xplained_Pro_Target_MCU (U300.3), SAMC21_Xplained_Pro_Connectors (J202.15), SAMC21_Xplained_Pro_Peripherals (J700.1)
PA03_ADC_DAC_VREF: SAMC21_Xplained_Pro_Target_MCU (U300.4), SAMC21_Xplained_Pro_Arduino_Connectors (J801.8), SAMC21_Xplained_Pro_Peripherals (C704.1 J701.4)
PA04_SDADC_VREF: SAMC21_Xplained_Pro_Target_MCU (U300.13), SAMC21_Xplained_Pro_Peripherals (C703.1 J701.3)
PA05_QTB_Y3: SAMC21_Xplained_Pro_Target_MCU (U300.14), SAMC21_Xplained_Pro_Peripherals (R701.2)
PA06_S0_LIN_TX: SAMC21_Xplained_Pro_Target_MCU (U300.15), SAMC21_Xplained_Pro_CAN_LIN (U501.4)
PA07_S0_LIN_RX: SAMC21_Xplained_Pro_Target_MCU (U300.16), SAMC21_Xplained_Pro_CAN_LIN (R504.1 U501.1)
PA08_AIN10_X0: SAMC21_Xplained_Pro_Target_MCU (U300.17), SAMC21_Xplained_Pro_Connectors (J201.3), SAMC21_Xplained_Pro_Arduino_Connectors (J803.3)
PA09_AIN11_X1: SAMC21_Xplained_Pro_Target_MCU (U300.18), SAMC21_Xplained_Pro_Connectors (J201.4), SAMC21_Xplained_Pro_Arduino_Connectors (J803.4)
PA10_GPIO_X2: SAMC21_Xplained_Pro_Target_MCU (U300.19), SAMC21_Xplained_Pro_Connectors (J201.5)
PA11_GPIO_X3: SAMC21_Xplained_Pro_Target_MCU (U300.20), SAMC21_Xplained_Pro_Connectors (J201.6)
PA12_S2_I2C_SDA: SAMC21_Xplained_Pro_Target_MCU (R305.1 U300.29), SAMC21_Xplained_Pro_Connectors (J200.11 J201.11 J202.11), SAMC21_Xplained_Pro_Arduino_Connectors (J801.9), SAMC21_Xplained_Pro_Level_Converters (U600.7), SAMC21_Xplained_Pro_Peripherals (U700.5 U701.5)
PA13_S2_I2C_SCL: SAMC21_Xplained_Pro_Target_MCU (R306.1 U300.30), SAMC21_Xplained_Pro_Connectors (J200.12 J201.12 J202.12), SAMC21_Xplained_Pro_Arduino_Connectors (J801.10), SAMC21_Xplained_Pro_Level_Converters (U600.6), SAMC21_Xplained_Pro_Peripherals (U700.6 U701.6)
PA14_PWM_TC4_W0: SAMC21_Xplained_Pro_Target_MCU (R313.2), SAMC21_Xplained_Pro_Connectors (J202.7)
PA15_PWM_TC4_W1: SAMC21_Xplained_Pro_Target_MCU (R314.2), SAMC21_Xplained_Pro_Connectors (J202.8), SAMC21_Xplained_Pro_Peripherals (D700.1)
PA16_S1_SPI_MISO: SAMC21_Xplained_Pro_Target_MCU (U300.35), SAMC21_Xplained_Pro_Connectors (J200.17)
PA17_S1_SPI_SS: SAMC21_Xplained_Pro_Target_MCU (U300.36), SAMC21_Xplained_Pro_Connectors (J200.15)
PA18_S1_SPI_MOSI_Y22: SAMC21_Xplained_Pro_Target_MCU (U300.37), SAMC21_Xplained_Pro_Connectors (J200.16)
PA19_S1_SPI_SCK_Y23: SAMC21_Xplained_Pro_Target_MCU (U300.38), SAMC21_Xplained_Pro_Connectors (J200.18)
PA20_GPIO_RTS_TE_Y26: SAMC21_Xplained_Pro_Target_MCU (U300.41), SAMC21_Xplained_Pro_Connectors (J200.5), SAMC21_Xplained_Pro_Arduino_Connectors (J804.3)
PA21_GPIO_CTS_Y27: SAMC21_Xplained_Pro_Target_MCU (U300.42), SAMC21_Xplained_Pro_Connectors (J200.6), SAMC21_Xplained_Pro_Arduino_Connectors (J804.5)
PA22_S3_UART_TX: SAMC21_Xplained_Pro_Target_MCU (U300.43), SAMC21_Xplained_Pro_Connectors (J200.14 J201.14 J202.14), SAMC21_Xplained_Pro_Arduino_Connectors (J804.2)
PA23_S3_UART_RX: SAMC21_Xplained_Pro_Target_MCU (U300.44), SAMC21_Xplained_Pro_Connectors (J200.13 J201.13 J202.13), SAMC21_Xplained_Pro_Arduino_Connectors (J804.1)
PA24_CAN0_TX: SAMC21_Xplained_Pro_Target_MCU (U300.45), SAMC21_Xplained_Pro_CAN_LIN (U500.1)
PA25_CAN0_RX: SAMC21_Xplained_Pro_Target_MCU (U300.46), SAMC21_Xplained_Pro_CAN_LIN (C501.1 U500.4)
PA27_GPIO_SS: SAMC21_Xplained_Pro_Target_MCU (U300.51), SAMC21_Xplained_Pro_Connectors (J202.10), SAMC21_Xplained_Pro_Arduino_Connectors (J801.3)
PA28_GPIO_IRQ8: SAMC21_Xplained_Pro_Target_MCU (U300.53), SAMC21_Xplained_Pro_Connectors (J202.9), SAMC21_Xplained_Pro_Level_Converters (R621.2), SAMC21_Xplained_Pro_Peripherals (R700.2)
PA30_SWCLK: SAMC21_Xplained_Pro_Target_MCU (R301.1 U300.57), SAMC21_Xplained_Pro_Connectors (J203.4), SAMC21_Xplained_Pro_Level_Converters (R612.2)
PA31_SWDIO: SAMC21_Xplained_Pro_Target_MCU (U300.58), SAMC21_Xplained_Pro_Connectors (J203.2), SAMC21_Xplained_Pro_Level_Converters (R611.2)
PB00_S5_SPI_MOSI: SAMC21_Xplained_Pro_Target_MCU (U300.61), SAMC21_Xplained_Pro_Connectors (J201.16 J202.16), SAMC21_Xplained_Pro_Arduino_Connectors (J800.4 J801.4), SAMC21_Xplained_Pro_Level_Converters (U610.4)
PB01_S5_SPI_SCK: SAMC21_Xplained_Pro_Target_MCU (U300.62), SAMC21_Xplained_Pro_Connectors (J201.18 J202.18), SAMC21_Xplained_Pro_Arduino_Connectors (J800.3 J801.6), SAMC21_Xplained_Pro_Level_Converters (U606.4)
PB02_S5_SPI_MISO: SAMC21_Xplained_Pro_Target_MCU (U300.63), SAMC21_Xplained_Pro_Connectors (J201.17 J202.17), SAMC21_Xplained_Pro_Arduino_Connectors (J800.1 J801.5), SAMC21_Xplained_Pro_Level_Converters (R614.2)
PB03_S5_SPI_SS: SAMC21_Xplained_Pro_Target_MCU (U300.64), SAMC21_Xplained_Pro_Connectors (J201.15)
PB04_GPIO: SAMC21_Xplained_Pro_Target_MCU (U300.5), SAMC21_Xplained_Pro_Connectors (J202.5), SAMC21_Xplained_Pro_Arduino_Connectors (J804.8)
PB05_GPIO: SAMC21_Xplained_Pro_Target_MCU (U300.6), SAMC21_Xplained_Pro_Connectors (J202.6), SAMC21_Xplained_Pro_Arduino_Connectors (J801.1)
PB06_AIN8_INN2: SAMC21_Xplained_Pro_Target_MCU (U300.9), SAMC21_Xplained_Pro_Connectors (J202.4), SAMC21_Xplained_Pro_Arduino_Connectors (J803.6)
PB07_AIN9_INP2: SAMC21_Xplained_Pro_Target_MCU (U300.10), SAMC21_Xplained_Pro_Connectors (J202.3), SAMC21_Xplained_Pro_Arduino_Connectors (J803.5)
PB08_INN1_Y14: SAMC21_Xplained_Pro_Target_MCU (U300.11), SAMC21_Xplained_Pro_Connectors (J200.4), SAMC21_Xplained_Pro_Arduino_Connectors (J803.2)
PB09_INP1_Y15: SAMC21_Xplained_Pro_Target_MCU (U300.12), SAMC21_Xplained_Pro_Connectors (J200.3), SAMC21_Xplained_Pro_Arduino_Connectors (J803.1)
PB10_S4_CDC_TX: SAMC21_Xplained_Pro_Target_MCU (U300.23), SAMC21_Xplained_Pro_Level_Converters (U602.4)
PB11_S4_CDC_RX: SAMC21_Xplained_Pro_Target_MCU (U300.24), SAMC21_Xplained_Pro_Level_Converters (R607.1)
PB12_PWM_TC0_W0: SAMC21_Xplained_Pro_Target_MCU (U300.25), SAMC21_Xplained_Pro_Connectors (J200.7), SAMC21_Xplained_Pro_Arduino_Connectors (J804.4), SAMC21_Xplained_Pro_Level_Converters (R618.2)
PB13_PWM_TC0_W1: SAMC21_Xplained_Pro_Target_MCU (U300.26), SAMC21_Xplained_Pro_Connectors (J200.8), SAMC21_Xplained_Pro_Arduino_Connectors (J804.6)
PB14_GPIO_IRQ14_Y30: SAMC21_Xplained_Pro_Target_MCU (U300.27), SAMC21_Xplained_Pro_Connectors (J200.9)
PB15_GPIO_SS_Y31: SAMC21_Xplained_Pro_Target_MCU (U300.28), SAMC21_Xplained_Pro_Connectors (J200.10)
PB16_GPIO_IRQ0: SAMC21_Xplained_Pro_Target_MCU (U300.39), SAMC21_Xplained_Pro_Connectors (J201.9), SAMC21_Xplained_Pro_Level_Converters (R619.2)
PB17_GPIO_SS: SAMC21_Xplained_Pro_Target_MCU (U300.40), SAMC21_Xplained_Pro_Connectors (J201.10), SAMC21_Xplained_Pro_Level_Converters (R620.2)
PB22_LIN_EN: SAMC21_Xplained_Pro_Target_MCU (U300.49), SAMC21_Xplained_Pro_CAN_LIN (U501.2)
PB23_SS_EN: SAMC21_Xplained_Pro_Target_MCU (U300.50), SAMC21_Xplained_Pro_Level_Converters (U604.4)
PB30_PWM_TCC0_W0: SAMC21_Xplained_Pro_Target_MCU (U300.59), SAMC21_Xplained_Pro_Connectors (J201.7), SAMC21_Xplained_Pro_Arduino_Connectors (J804.7)
PB31_PWM_TCC0_W1: SAMC21_Xplained_Pro_Target_MCU (U300.60), SAMC21_Xplained_Pro_Connectors (J201.8), SAMC21_Xplained_Pro_Arduino_Connectors (J801.2)
~{TARGET_VCC_ENABLE}: SAMC21_Xplained_Pro_EDBG (U400.J10), SAMC21_Xplained_Pro_dual_input_power_supply (Q102.1 R105.2)
TARGET_RESET: SAMC21_Xplained_Pro_EDBG (U400.B4), SAMC21_Xplained_Pro_Level_Converters (Q601.3 R624.1)
TARGET_RESET_CON: SAMC21_Xplained_Pro_Connectors (J203.10), SAMC21_Xplained_Pro_Arduino_Connectors (R800.1), SAMC21_Xplained_Pro_Level_Converters (R609.1 R610.2)
TARGET_RESET_SENSE: SAMC21_Xplained_Pro_Target_MCU (C301.1 R300.1 R304.2 U300.52), SAMC21_Xplained_Pro_Level_Converters (R609.2)
TARGET_RESET_SENSE_LEVEL: SAMC21_Xplained_Pro_EDBG (U400.H2), SAMC21_Xplained_Pro_Level_Converters (Q600.6 R603.1)

## Assembly variants
Default_assembly: not fitted C318 C319 C403 R424 U700 U701 XC301